# EAGLE design Piggyback PhotonenDetector (EAGLE 6.5.0)
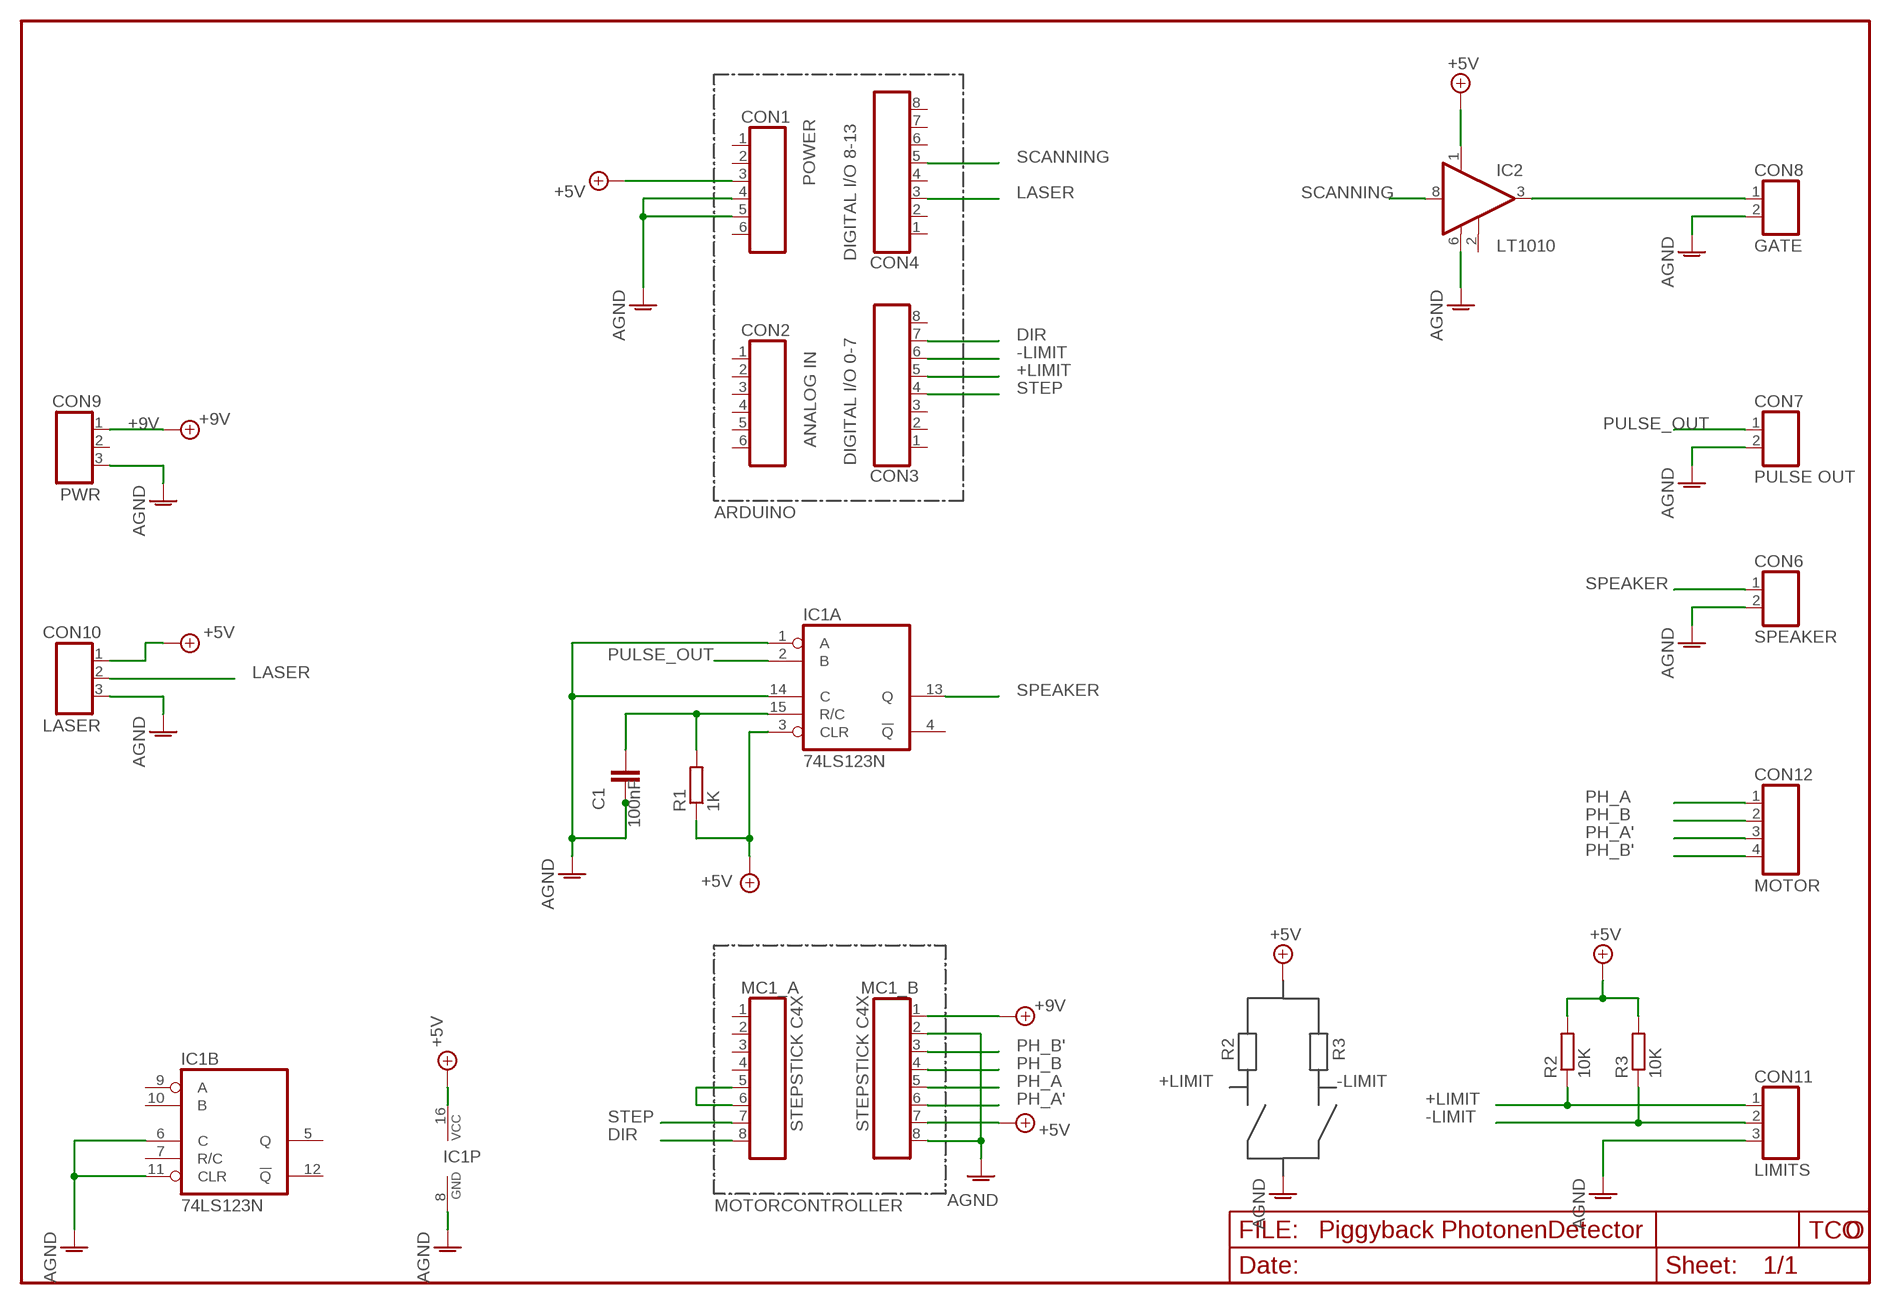
[diagram p0: schematic, sheet 1]

## Parts
C1  100nF  C-EU025_050-025X075  [C025_050-025X075]
CON1  POWER  HD6-HDR-S  [HDR-06-2.54]
CON2  ANALOG IN  HD6-HDR-S  [HDR-06-2.54]
CON3  DIGITAL I/O 0-7  HD8-HDR-S  [HDR-08-2.54]
CON4  DIGITAL I/O 8-13  HD8-HDR-S  [HDR-08-2.54]
CON6  SPEAKER  HD2-HDR-S  [HDR-02-2.54]
CON7  PULSE OUT  HD2-HDR-S  [HDR-02-2.54]
CON8  GATE  HD2-HDR-S  [HDR-02-2.54]
CON9  PWR  HD3-HDR-S  [HDR-03-2.54]
CON10  LASER  HD3-HDR-S  [HDR-03-2.54]
CON11  LIMITS  HD3-HDR-S  [HDR-03-2.54]
CON12  MOTOR  HD4-HDR-S  [HDR-04-2.54]
IC1  74LS123N  [DIL16]
IC2  LT1010  LT1010N8  [DIL08]
MC1_A  STEPSTICK C4X  HD8-HDR-S  [HDR-08-2.54]
MC1_B  STEPSTICK C4X  HD8-HDR-S  [HDR-08-2.54]
R1  1K  R-EU_0207/10  [0207/10]
R2  10K  R-EU_0207/10  [0207/10]
R3  10K  R-EU_0207/10  [0207/10]

## Nets
+5V: CON1.3 CON10.1 IC1.3(A:CLR) IC1.16(P:VCC) IC2.1(V+) MC1_B.7 R1.1 R2.2 R3.2
+9V: CON9.1 MC1_B.1
+LIMIT: CON3.5 CON11.1 R2.1
-LIMIT: CON3.6 CON11.2 R3.1
AGND [GND]: C1.2 C1.3 CON1.4 CON1.5 CON6.2 CON7.2 CON8.2 CON9.3 CON10.3 CON11.3 IC1.1(A:A) IC1.6(B:C) IC1.8(P:GND) IC1.11(B:CLR) IC1.14(A:C) IC2.6(V-) MC1_B.2 MC1_B.8
DIR: CON3.7 MC1_A.8
LASER: CON4.3 CON10.2
N$1: C1.1 IC1.15(A:R/C) R1.2
N$2: MC1_A.5 MC1_A.6
N$13: CON8.1 IC2.3(OUT)
PH_A: CON12.1 MC1_B.5
PH_A': CON12.3 MC1_B.6
PH_B: CON12.2 MC1_B.4
PH_B': CON12.4 MC1_B.3
PULSE_OUT: CON7.1 IC1.2(A:B)
SCANNING: CON4.5 IC2.8(+IN)
SPEAKER: CON6.1 IC1.13(A:Q)
STEP: CON3.4 MC1_A.7
Unconnected: CON1.1 CON1.2 CON1.6 CON2.1 CON2.2 CON2.3 CON2.4 CON2.5 CON2.6 CON3.1 CON3.2 CON3.3 CON3.8 CON4.1 CON4.2 CON4.4 CON4.6 CON4.7 CON4.8 CON9.2 IC1.4(A:!Q) IC1.5(B:Q) IC1.7(B:R/C) IC1.9(B:A) IC1.10(B:B) IC1.12(B:!Q) IC2.2(BIAS) MC1_A.1 MC1_A.2 MC1_A.3 MC1_A.4

## Notes on the sheet
- ARDUINO
- R2 | R3
- +LIMIT | -LIMIT
- MOTORCONTROLLER

## Library data of the parts
C1 = !HW-LBR:C-EU: CAPACITOR, European symbol
CON1 CON2 = !TCO-connectors:HD6: 6 pins header / connector HDR6 HDR2x3 header6 CON6 berg, phoenix, molex, etc
CON3 CON4 MC1_A MC1_B = !TCO-connectors:HD8: 8 pins header / connector HDR8 HDR2x4 header8 CON8
CON6-CON8 = !TCO-connectors:HD2: 2 pins header / connector HDR2 header2 CON2 berg, phoenix, molex, etc
CON9-CON11 = !TCO-connectors:HD3: 3 pins header / connector HDR3 header3 CON3 berg, phoenix, molex, etc
CON12 = !TCO-connectors:HD4: 4 pins header / connector HDR4 HDR2x2 header4 CON4 berg, phoenix, molex, etc
IC1 = 74xx-eu:74*123: Retriggerable monostable MULTIVIBRATOR
IC2 = !HW-LBR:LT1010: Fast ±150mA Power Buffer Source: http://http://cds.linear.com/docs/en/datasheet/1010fe.pdf
R1-R3 = rcl:R-EU_: RESISTOR, European symbol

## Net classes
0 default: width 0.203 mm, drill 0.406 mm, clearance 0.203 mm
1 Power: width 0.203 mm, drill 0.406 mm, clearance 0.305 mm to class 0, clearance 0.305 mm
2 GND: width 0.203 mm, drill 0.406 mm, clearance 0.305 mm to class 0, clearance 0.305 mm to class 1, clearance 0.305 mm

## Board
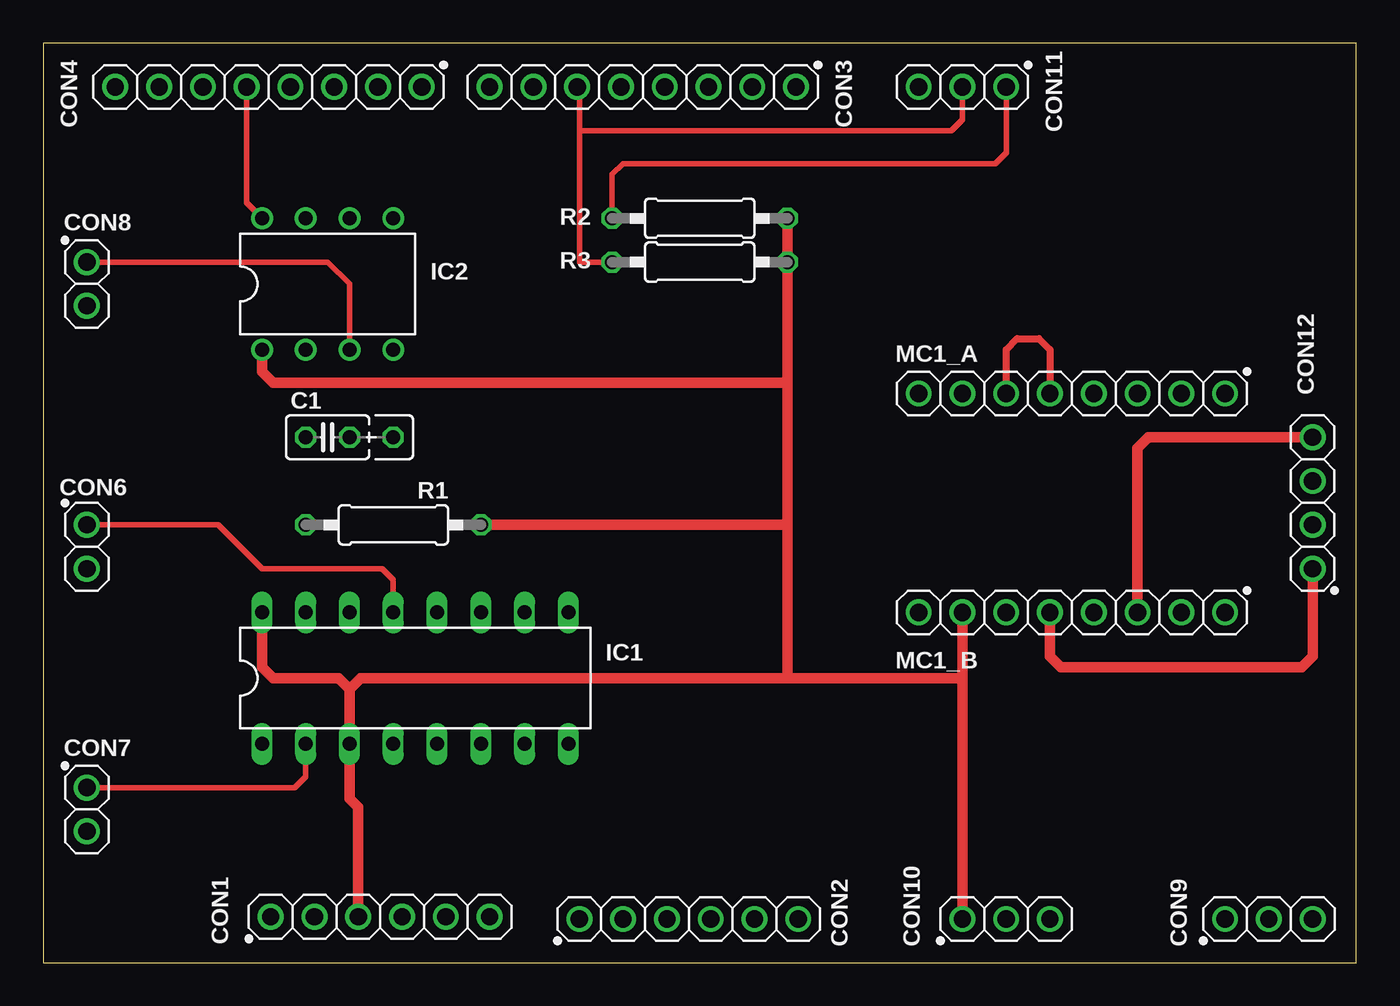
[diagram p1: board, top side]
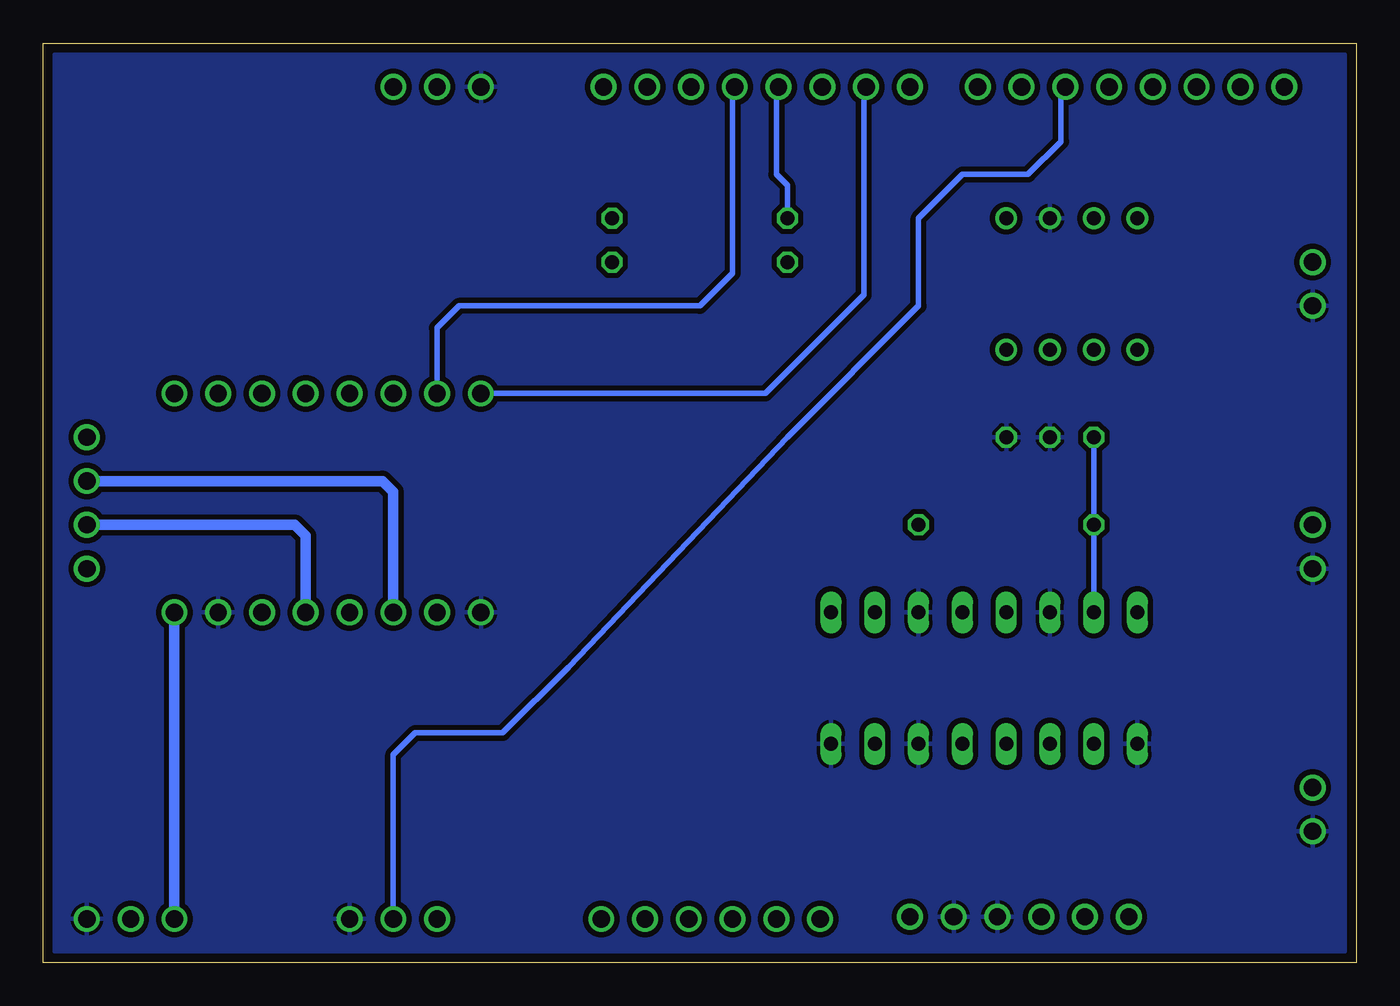
[diagram p2: board, bottom side, seen from below]

Size 76.2 x 53.34 mm. Coordinates in mm from the lower left corner, seen from the top.
Outline: 76.2,0 76.2,53.34 0,53.34 0,0 76.2,0
Copper layers (1*16): Top 0.018mm / dielectric 1.55mm / Bottom 0.018mm
Design rules "eC_2Layer_PClass6_BaseCopperO18_eCDefault": minimum track width 0.15mm, minimum drill 0.35mm, track to track 0.15mm, track to pad 0.15mm, pad to pad 0.15mm, via to via 0.15mm, smd to smd 0mil, copper to edge 0.25mm, drill to drill 0.35mm, minimum pad ring 0.18mm, minimum via ring 0.18mm, stop-mask expansion 0mil, vias tented up to drill 0.45mm, thermal gap 0.2mm

### Footprints (pad centres in the part's own frame; a part is rotated, then mirrored left to right if it is on the bottom)
C025_050-025X075 = drill 0.813 octagon: 1 -1.27,0; 2 1.27,0; 3 3.81,0
HDR-06-2.54 = drill 1: 1 -6.35,0; 2 -3.81,0; 3 -1.27,0; 4 1.27,0; 5 3.81,0; 6 6.35,0
HDR-08-2.54 = drill 1: 1 -8.89,0; 2 -6.35,0; 3 -3.81,0; 4 -1.27,0; 5 1.27,0; 6 3.81,0; 7 6.35,0; 8 8.89,0
HDR-02-2.54 = drill 1: 1 -1.27,0; 2 1.27,0
HDR-03-2.54 = drill 1: 1 -2.54,0; 2 0,0; 3 2.54,0
HDR-04-2.54 = drill 1: 1 -3.81,0; 2 -1.27,0; 3 1.27,0; 4 3.81,0
DIL16 = drill 0.813 long: 1 -8.89,-3.81; 2 -6.35,-3.81; 3 -3.81,-3.81; 4 -1.27,-3.81; 5 1.27,-3.81; 6 3.81,-3.81; 7 6.35,-3.81; 8 8.89,-3.81; 9 8.89,3.81; 10 6.35,3.81; 11 3.81,3.81; 12 1.27,3.81; 13 -1.27,3.81; 14 -3.81,3.81; 15 -6.35,3.81; 16 -8.89,3.81
DIL08 = drill 0.813 pad 1.27: 1 -3.81,-3.81; 2 -1.27,-3.81; 3 1.27,-3.81; 4 3.81,-3.81; 5 3.81,3.81; 6 1.27,3.81; 7 -1.27,3.81; 8 -3.81,3.81
0207/10 = drill 0.813 octagon: 1 -5.08,0; 2 5.08,0

### Placement (x,y rotation side)
C1  16.51,30.48 0 top
CON1  19.56,2.67 0 top
CON2  37.47,2.54 0 top
CON3  34.8,50.8 180 top
CON4  13.08,50.8 180 top
CON6  2.54,24.13 270 top
CON7  2.54,8.89 270 top
CON8  2.54,39.37 270 top
CON9  71.12,2.54 0 top
CON10  55.88,2.54 0 top
CON11  53.34,50.8 180 top
CON12  73.66,26.67 90 top
IC1  21.59,16.51 0 top
IC2  16.51,39.37 0 top
MC1_A  59.69,33.02 180 top
MC1_B  59.69,20.32 180 top
R1  20.32,25.4 180 top
R2  38.1,43.18 0 top
R3  38.1,40.64 0 top

### Tracks (layer width: path | path; a pad name or v marks a point on that pad's centre or on a via)
+5V
  Top 0.61: MC1_B.7 53.34,16.51 | 53.34,16.51 CON10.1 | 17.78,15.88 IC1.3 17.78,9.53 18.29,9.02 CON1.3 | 17.78,15.88 18.41,16.51 43.18,16.51 | 43.18,16.51 43.18,25.4 | 43.18,25.4 43.18,33.66 | 43.18,33.66 R3.2 R2.2 | R1.1 43.18,25.4 | IC2.1 12.7,34.29 13.34,33.66 43.18,33.66 | 43.18,16.51 53.34,16.51 | 17.78,15.88 17.14,16.51 13.34,16.51 12.7,17.14 IC1.16
+9V
  Bottom 0.61: MC1_B.1 CON9.1
+LIMIT
  Top 0.305: CON11.1 55.88,46.99 55.24,46.35 33.66,46.35 33.02,45.72 R2.1
  Bottom 0.305: CON3.5 33.66,50.8 33.66,45.72 33.02,45.09 R2.1
-LIMIT
  Top 0.305: CON11.2 53.34,48.9 52.7,48.26 31.11,48.26 | 31.11,48.26 31.11,50.67 CON3.6 | R3.1 31.11,40.64 31.11,48.26
AGND
  pour Bottom: 75.56,52.7 0.64,52.7 0.64,0.64 75.56,0.64
DIR
  Bottom 0.305: MC1_A.8 34.29,33.02 28.57,38.73 28.57,50.67 CON3.7
LASER
  Bottom 0.305: CON10.2 55.88,12.06 54.61,13.34 49.53,13.34 45.72,17.14 33.02,30.48 25.4,38.1 25.4,43.18 22.86,45.72 19.05,45.72 17.14,47.62 17.14,50.55 CON4.3
N$1
  Bottom 0.305: C1.1 R1.2 IC1.15
N$2
  Top 0.406: MC1_A.6 55.88,35.56 56.52,36.2 57.78,36.2 58.42,35.56 MC1_A.5
N$13
  Top 0.305: IC2.3 17.78,39.37 16.51,40.64 CON8.1
PH_A
  Top 0.61: MC1_B.5 58.42,17.78 59.05,17.14 73.03,17.14 73.66,17.78 CON12.1
PH_A'
  Bottom 0.61: CON12.3 56.52,27.94 55.88,27.3 MC1_B.6
PH_B
  Bottom 0.61: CON12.2 61.59,25.4 60.96,24.77 MC1_B.4
PH_B'
  Top 0.61: CON12.4 64.14,30.48 63.5,29.84 MC1_B.3
PULSE_OUT
  Top 0.305: CON7.1 14.61,10.16 15.24,10.79 IC1.2
SCANNING
  Top 0.305: CON4.5 11.81,44.07 IC2.8
SPEAKER
  Top 0.305: CON6.1 10.16,25.4 12.7,22.86 19.68,22.86 20.32,22.23 IC1.13
STEP
  Bottom 0.305: CON3.4 36.2,50.8 36.2,40.01 38.1,38.1 52.07,38.1 53.34,36.83 MC1_A.7

### Text on the board
tDocu: AREF | GND | 13 | 12 | 11 | 10 | 9 | 8 | 7 | 6 | 5 | 4 | 3 | 2 | 1 | 0 | PIGGYBACK PHOTONENDETECTOR.PCB | 05-2014 | 2B | 1B | 2A | 1A | RST | 3V | 5V | GND | Vin | 0 | 1 | 2 | 3 | 4 | 5 | GND | +9V